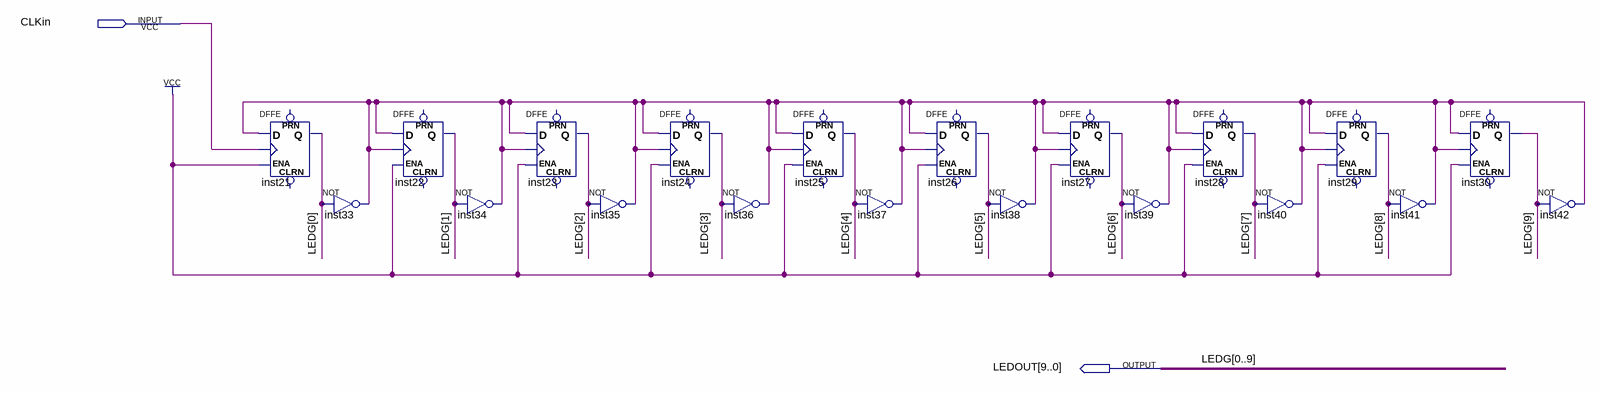
[diagram p0: schematic sheet]
// Quartus schematic counter.bdf as structural Verilog: 20 symbols, 2 pins
module counter (
  input  CLKin,
  output [9:0] LEDOUT
);

  wire inst33_out;

  DFFE inst21 (.D(inst33_out), .CLK(CLKin), .ENA(1'b1), .Q(LEDOUT[9]));  // open: PRN, CLRN
  not inst33 (inst33_out, LEDOUT[9]);
  DFFE inst22 (.D(inst33_out), .CLK(inst33_out), .ENA(1'b1), .Q(LEDOUT[8]));  // open: PRN, CLRN
  not inst34 (inst33_out, LEDOUT[8]);
  DFFE inst23 (.D(inst33_out), .CLK(inst33_out), .ENA(1'b1), .Q(LEDOUT[7]));  // open: PRN, CLRN
  not inst35 (inst33_out, LEDOUT[7]);
  DFFE inst24 (.D(inst33_out), .CLK(inst33_out), .ENA(1'b1), .Q(LEDOUT[6]));  // open: PRN, CLRN
  not inst36 (inst33_out, LEDOUT[6]);
  DFFE inst25 (.D(inst33_out), .CLK(inst33_out), .ENA(1'b1), .Q(LEDOUT[5]));  // open: PRN, CLRN
  not inst37 (inst33_out, LEDOUT[5]);
  DFFE inst26 (.D(inst33_out), .CLK(inst33_out), .ENA(1'b1), .Q(LEDOUT[4]));  // open: PRN, CLRN
  not inst38 (inst33_out, LEDOUT[4]);
  DFFE inst27 (.D(inst33_out), .CLK(inst33_out), .ENA(1'b1), .Q(LEDOUT[3]));  // open: PRN, CLRN
  not inst39 (inst33_out, LEDOUT[3]);
  DFFE inst28 (.D(inst33_out), .CLK(inst33_out), .ENA(1'b1), .Q(LEDOUT[2]));  // open: PRN, CLRN
  not inst40 (inst33_out, LEDOUT[2]);
  DFFE inst29 (.D(inst33_out), .CLK(inst33_out), .ENA(1'b1), .Q(LEDOUT[1]));  // open: PRN, CLRN
  not inst41 (inst33_out, LEDOUT[1]);
  DFFE inst30 (.D(inst33_out), .CLK(inst33_out), .ENA(1'b1), .Q(LEDOUT[0]));  // open: PRN, CLRN
  not inst42 (inst33_out, LEDOUT[0]);

  // Other names for the same wires on the sheet: LEDG[9:0] = {LEDOUT[0], LEDOUT[1], LEDOUT[2], LEDOUT[3], LEDOUT[4], LEDOUT[5], LEDOUT[6], LEDOUT[7], LEDOUT[8], LEDOUT[9]}
endmodule
